# EAGLE design audioplayer (EAGLE 6.5.0)
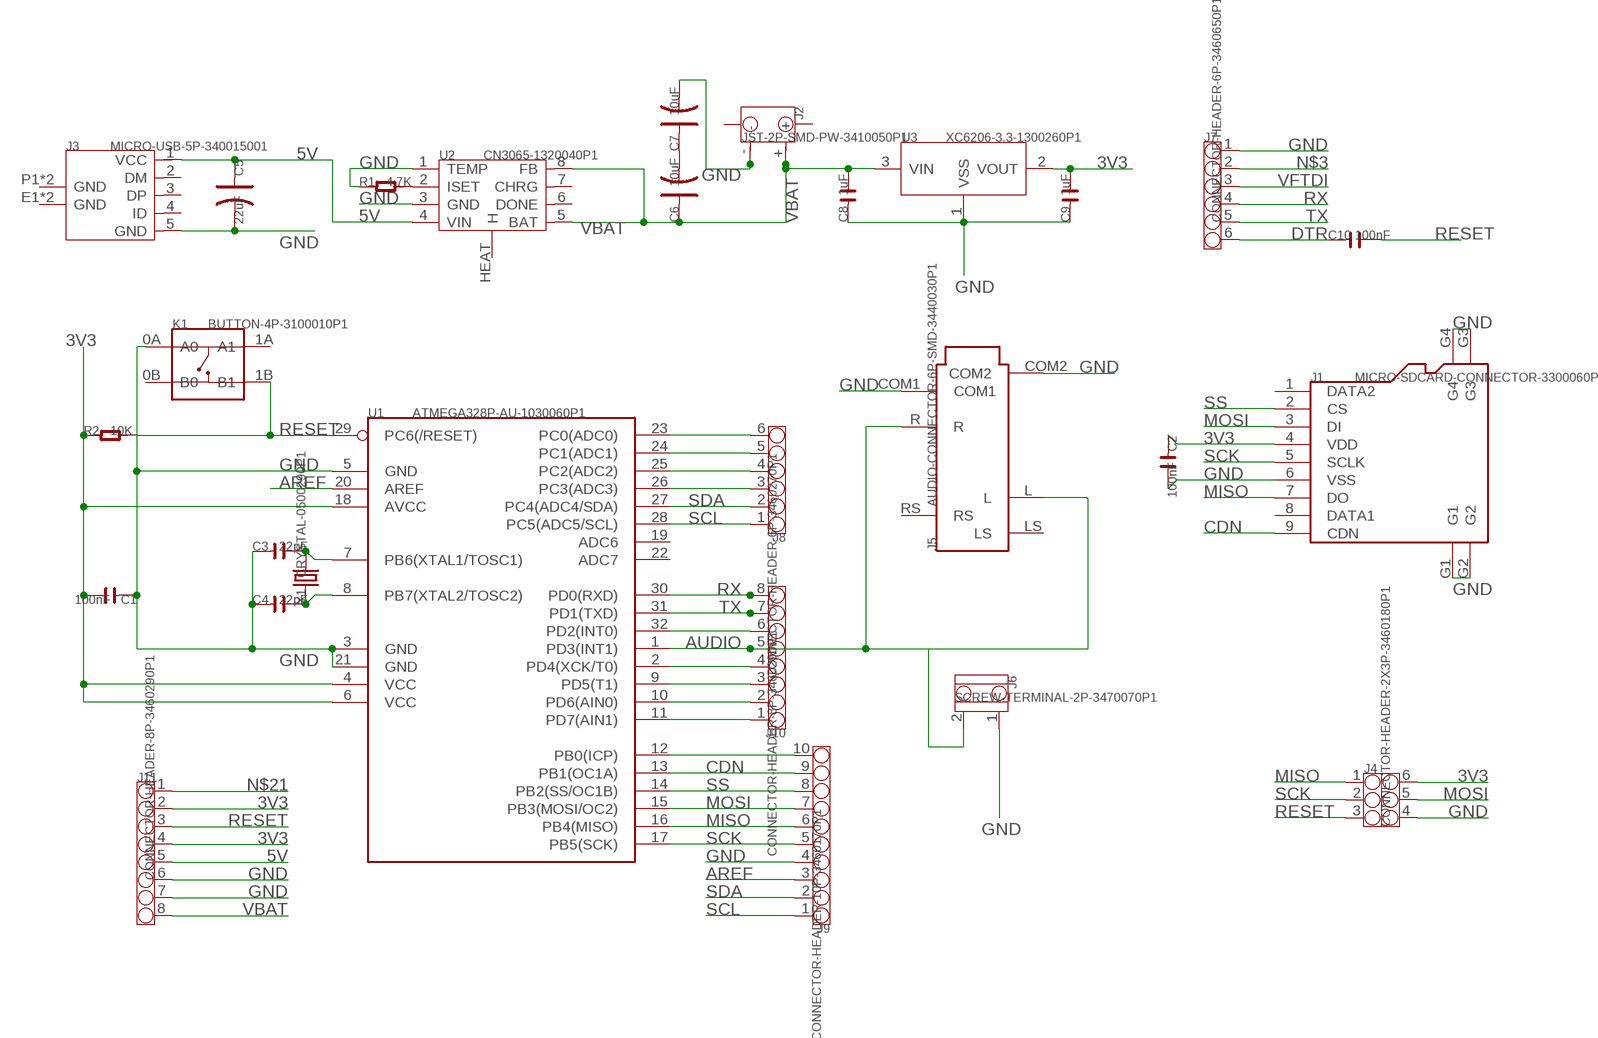
[diagram p0: schematic, sheet 1]

## Parts
C1  100nF  C-0603  [C0603]
C2  100nF  C-0603  [C0603]
C3  22pF  C-0603  [C0603]
C4  22pF  C-0603  [C0603]
C5  22uF  C-POLAR-B  [AVX-B]
C6  10uF  C-POLAR-A  [AVX-A]
C7  10uF  C-POLAR-A  [AVX-A]
C8  1uF  C-0805  [C0805]
C9  1uF  C-0805  [C0805]
C10  100nF  C-0603  [C0603]
J1  MICRO-SDCARD-CONNECTOR-3300060P1  [9P-SMD-W-RING]
J2  JST-2P-SMD-PW-3410050P1  [2P-SMD-2.0-90D]
J3  MICRO-USB-5P-340015001  [B-SMD-5P]
J4  CONNECTOR-HEADER-2X3P-3460180P1  [2X3P-2.54-2.54-11.6-3.0-BLACK-MALE]
J5  AUDIO-CONNECTOR-6P-SMD-3440030P1  [6P-SMD-3.5]
J6  SCREW-TERMINAL-2P-3470070P1  [2P-3.5]
J7  CONNECTOR-HEADER-6P-3460650P1  [1X6P-2.54-2.54-11.6-3.0-BLACK-MALE]
J8  CONNECTOR-HEADER-6P-3460270P1  [1X6P-2.54-8.5-BLACK-FEMALE]
J9  CONNECTOR-HEADER-10P-3460170P1  [1X10P-2.54-8.5-YELLOW-FEMALE]
J10  CONNECTOR-HEADER-8P-3460290P1  [1X8P-2.54-8.5-BLACK-FEMALE]
J11  CONNECTOR-HEADER-8P-3460290P1  [1X8P-2.54-8.5-BLACK-FEMALE]
K1  BUTTON-4P-3100010P1  [4P-SMD-6.0X6.0X5.0H]
R1  4.7K  R-0603  [R0603]
R2  10K  R-0603  [R0603]
U1  ATMEGA328P-AU-1030060P1  [TQFP32]
U2  CN3065-1320040P1  [DFN8]
U3  XC6206-3.3-1300260P1  [SOT23]
X1  CRYSTAL-0500290P1  [2P-SMD-5.0X3.2]

## Nets
3V3 [power]: C1.2 C2.1 C9.2 J1.4(VDD) J4.6 J11.2 J11.4 R2.1 U1.4(VCC) U1.6(VCC) U1.18(AVCC) U3.2(VOUT)
5V [power]: C5.+ J3.1(VCC) J11.5 U2.4(VIN)
AREF: J9.3 U1.20(AREF)
AUDIO: J5.L J5.R J6.2 J10.5 U1.1(PD3(INT1))
CDN: J1.9(CDN) J9.9 U1.13(PB1(OC1A))
DTR: C10.1 J7.6
GND [power]: C1.1 C2.2 C3.1 C4.1 C5.- C7.- C8.1 C9.1 J1.6(VSS) J1.G1 J1.G2 J1.G3 J1.G4 J2.- J3.5(GND) J4.4 J5.COM1 J5.COM2 J6.1 J7.1 J9.4 J11.6 J11.7 K1.0A(A0) R1.1 U1.3(GND) U1.5(GND) U1.21(GND) U2.1(TEMP) U2.3(GND) U3.1(VSS)
MISO: J1.7(DO) J4.1 J9.6 U1.16(PB4(MISO))
MOSI: J1.3(DI) J4.5 J9.7 U1.15(PB3(MOSI/OC2))
N$1: C6.- C7.+
N$2: R1.2 U2.2(ISET)
N$3: J7.2
N$6: J8.3 U1.26(PC3(ADC3))
N$7: J8.4 U1.25(PC2(ADC2))
N$8: J8.5 U1.24(PC1(ADC1))
N$9: J8.6 U1.23(PC0(ADC0))
N$10: J9.10 U1.12(PB0(ICP))
N$11: J10.1 U1.11(PD7(AIN1))
N$12: J10.2 U1.10(PD6(AIN0))
N$13: J10.3 U1.9(PD5(T1))
N$14: J10.4 U1.2(PD4(XCK/T0))
N$15: J10.6 U1.32(PD2(INT0))
N$21: J11.1
N$25: C3.2 U1.7(PB6(XTAL1/TOSC1)) X1.2
N$28: C4.2 U1.8(PB7(XTAL2/TOSC2)) X1.1
RESET: C10.2 J4.3 J11.3 K1.1B(B1) R2.2 U1.29(PC6(/RESET))
RX: J7.4 J10.8 U1.30(PD0(RXD))
SCK: J1.5(SCLK) J4.2 J9.5 U1.17(PB5(SCK))
SCL: J8.1 J9.1 U1.28(PC5(ADC5/SCL))
SDA: J8.2 J9.2 U1.27(PC4(ADC4/SDA))
SS: J1.2(CS) J9.8 U1.14(PB2(SS/OC1B))
TX: J7.5 J10.7 U1.31(PD1(TXD))
VBAT [power]: C6.+ C8.2 J2.+ J11.8 U2.5(BAT) U2.8(FB) U3.3(VIN)
VFTDI [power]: J7.3
Unconnected: J1.1(DATA2) J1.8(DATA1) J2.3 J2.4 J3.2(DM) J3.3(DP) J3.4(ID) J3.E1(GND) J3.E2(GND) J3.P1(GND) J3.P2(GND) J5.LS J5.RS K1.0B(B0) K1.1A(A1) U1.19(ADC6) U1.22(ADC7) U2.6(DONE) U2.7(CHRG) U2.HEAT(H)

## Library data of the parts
C1-C4 C8-C10 = OPL:C*
C5-C7 = OPL:C-POLAR*
J1 = OPL:MICRO-SDCARD-CONNECTOR: Micro SD Card
J2 = OPL:JST-2P-SMD-PW
J3 = OPL:MICRO-USB-5P: ST-USB-001E：MICRO USB B SMD R/A
J4 = OPL:CONNECTOR-HEADER-2X3P
J5 = OPL:AUDIO-CONNECTOR-6P-SMD
J6 = OPL:SCREW-TERMINAL-2P
J7 J8 = OPL:CONNECTOR-HEADER-6P
J9 = OPL:CONNECTOR-HEADER-10P
J10 J11 = OPL:CONNECTOR-HEADER-8P
K1 = OPL:BUTTON-4P
R1 R2 = OPL:R*
U1 = OPL:ATMEGA328P-AU: 8-bit AVR Microcontroller with 32K Bytes In-System Programmable Flash
U2 = OPL:CN3065: USB-Compatible Lithiumt-Ion Battery Charger with Thermal Regulation http://www.consonance-elec.com/pdf/%E6%8A%80%E6%9C%AF%E8%AF%B4%E6%98%8E%E4%B9%A6/DSC-CN3065.pdf
U3 = OPL:XC6206-3.3: LOW ESR Cap.Compatible Positive Voltage Regulators
X1 = OPL:CRYSTAL*

## Net classes
1 power: width 0.254 mm

## Board
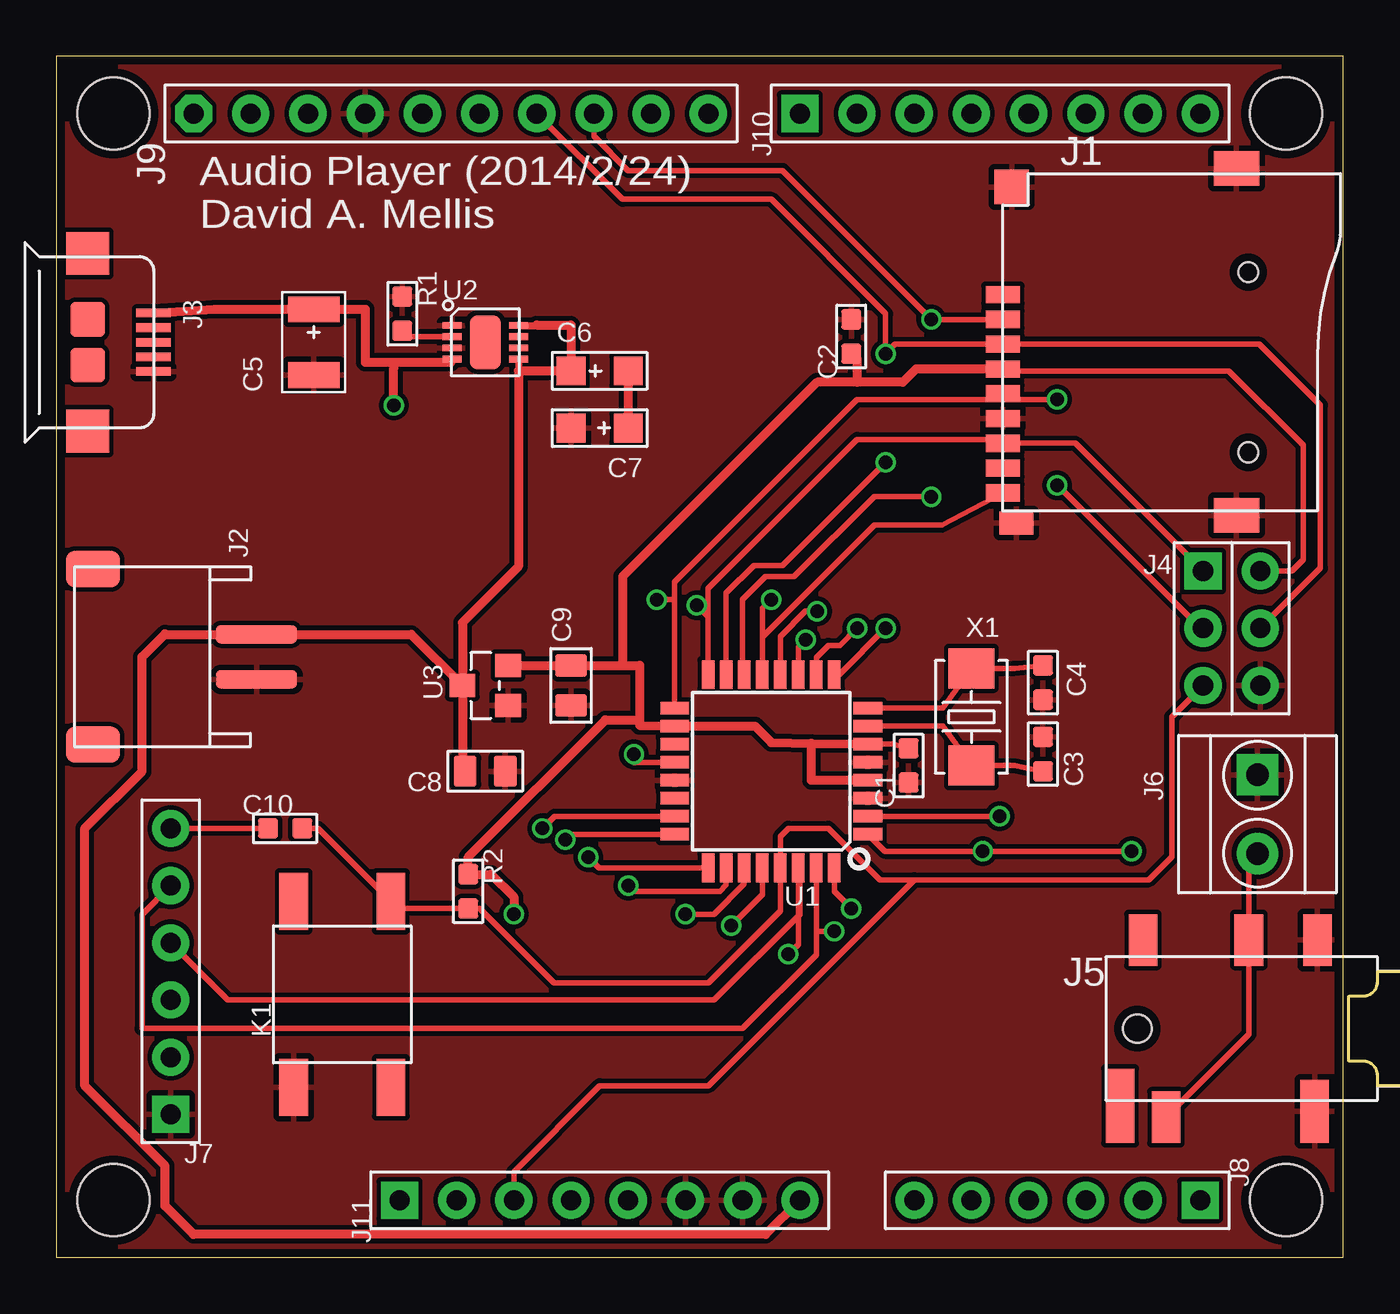
[diagram p1: board, top side]
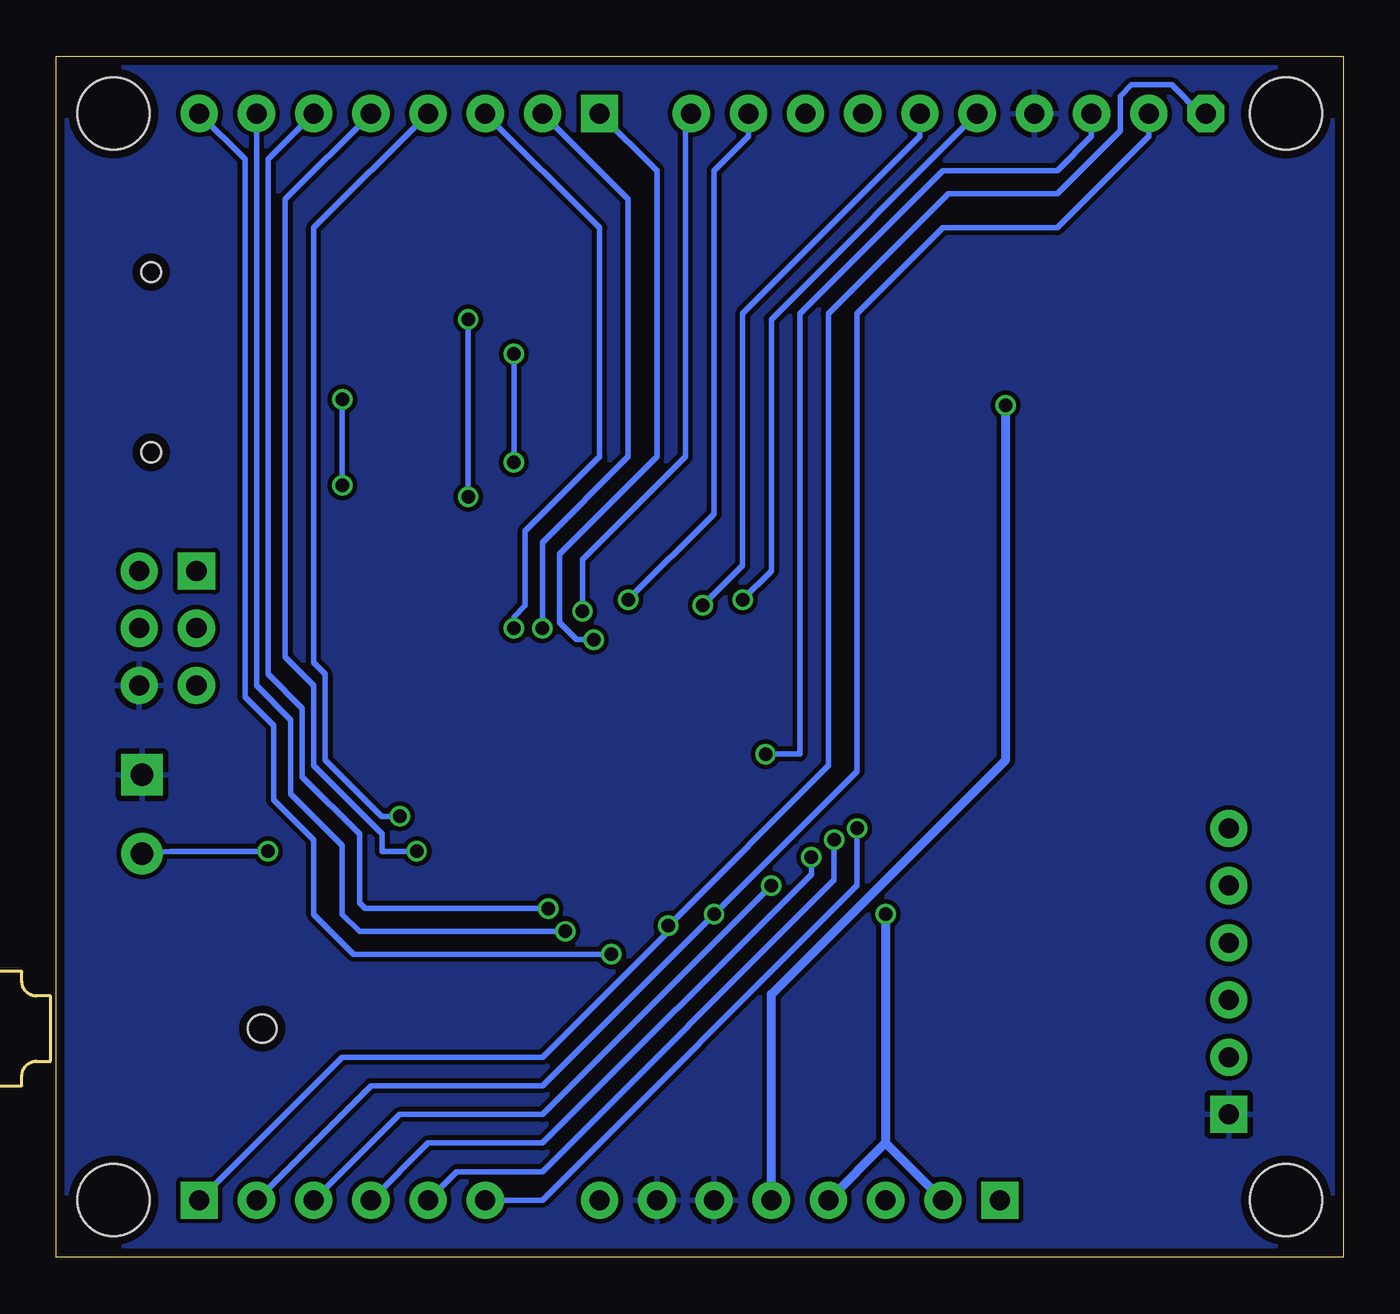
[diagram p2: board, bottom side, seen from below]

Size 57.15 x 53.34 mm. Coordinates in mm from the lower left corner, seen from the top.
Outline: 57.15,0 57.15,53.34 0,53.34 0,0 57.15,0
Copper layers (1*2*15*16): Top 0.035mm / dielectric 0.2mm / Route2 0.0175mm / dielectric 1.1mm / Route15 0.0175mm / dielectric 0.2mm / Bottom 0.035mm
Design rules "SeeedStudio_DRU_no_angle_20130527 *": minimum track width 6mil, minimum drill 12mil, track to track 8mil, track to pad 8mil, pad to pad 8mil, via to via 8mil, smd to smd 0mil, copper to edge 15mil, drill to drill 15mil, minimum pad ring 6mil, minimum via ring 6mil, stop-mask expansion 2mil, vias tented up to drill 25mil, thermal gap 10mil
Holes 3.2 mm at 54.61,2.54 54.61,50.8 2.54,50.8 2.54,2.54

### Footprints (pad centres in the part's own frame; a part is rotated, then mirrored left to right if it is on the bottom)
C0603 = smd 0.889 x 0.889: 1 -0.762,0; 2 0.762,0
AVX-B = smd 1.143 x 2.286: + -1.46,0; - 1.46,0
AVX-A = smd 1.27 x 1.27: + -1.27,0; - 1.27,0
C0805 = smd 1.016 x 1.397: 1 -0.889,0; 2 0.889,0
9P-SMD-W-RING = smd 1.524 x 0.762: 1 -7.493,2.114; 2 -7.493,1.014; 3 -7.493,-0.086; 4 -7.493,-1.186; 5 -7.493,-2.286; 6 -7.493,-3.386; 7 -7.493,-4.486; 8 -7.493,-5.586; 9 -7.493,-6.686 | smd 1.524 x 1.016: G1 -6.893,-8.032 | smd 2.032 x 1.524: G2 2.88,-7.686; G3 2.88,7.714 | smd 1.524 x 1.524: G4 -7.101,6.895 | hole 0.889: 3.407,-4.886; 3.407,3.114
2P-SMD-2.0-90D = smd 1.6 x 2.4: 3 3.9,-2.181; 4 -3.9,-2.181 | smd 0.8 x 3.6: + -1,5.08; - 1,5.08
B-SMD-5P = smd 0.38 x 1.52: 1 -1.3,2.54; 2 -0.65,2.54; 3 0,2.54; 4 0.65,2.54; 5 1.3,2.54 | smd 1.524 x 1.524: E1 -1.016,-0.381; E2 1.016,-0.381 | smd 1.9 x 1.9: P1 -3.95,-0.381; P2 3.95,-0.381
2X3P-2.54-2.54-11.6-3.0-BLACK-MALE = drill 0.889 pad 1.651 square: 1 -1.27,2.54 | drill 0.889 pad 1.651: 2 -1.27,0; 3 -1.27,-2.54; 4 1.27,-2.54; 5 1.27,0; 6 1.27,2.54
6P-SMD-3.5 = smd 1.27 x 2.286: COM1 2.413,3.937; L -4.318,-3.937; R -0.635,3.937; RS -5.334,3.937 | smd 1.27 x 2.794: COM2 2.286,-3.683 | smd 1.27 x 3.302: LS -6.35,-3.429 | hole 1.27: -5.588,0
2P-3.5 = drill 1 pad 1.85 square: 1 -1.75,0 | drill 1 pad 1.85: 2 1.75,0
1X6P-2.54-2.54-11.6-3.0-BLACK-MALE = drill 0.889 pad 1.651 square: 1 0,6.35 | drill 0.889 pad 1.651: 2 0,3.81; 3 0,1.27; 4 0,-1.27; 5 0,-3.81; 6 0,-6.35
1X6P-2.54-8.5-BLACK-FEMALE = drill 0.889 pad 1.651 square: 1 0,6.35 | drill 0.889 pad 1.651: 2 0,3.81; 3 0,1.27; 4 0,-1.27; 5 0,-3.81; 6 0,-6.35
1X10P-2.54-8.5-YELLOW-FEMALE = drill 0.889 pad 1.651 octagon: 1 0,11.43 | drill 0.889 pad 1.651: 2 0,8.89; 3 0,6.35; 4 0,3.81; 5 0,1.27; 6 0,-1.27; 7 0,-3.81; 8 0,-6.35; 9 0,-8.89; 10 0,-11.43
1X8P-2.54-8.5-BLACK-FEMALE = drill 0.889 pad 1.651 square: 1 0,8.89 | drill 0.889 pad 1.651: 2 0,6.35; 3 0,3.81; 4 0,1.27; 5 0,-1.27; 6 0,-3.81; 7 0,-6.35; 8 0,-8.89
4P-SMD-6.0X6.0X5.0H = smd 2.54 x 1.27: 0A -4.129,2.159; 0B 4.129,2.159; 1A -4.129,-2.159; 1B 4.129,-2.159
R0603 = smd 0.889 x 0.889: 1 -0.762,0; 2 0.762,0
TQFP32 = smd 1.27 x 0.559: 1 -4.293,2.8; 2 -4.293,2; 3 -4.293,1.2; 4 -4.293,0.4; 5 -4.293,-0.4; 6 -4.293,-1.2; 7 -4.293,-2; 8 -4.293,-2.8; 17 4.293,-2.8; 18 4.293,-2; 19 4.293,-1.2; 20 4.293,-0.4; 21 4.293,0.4; 22 4.293,1.2; 23 4.293,2; 24 4.293,2.8 | smd 0.559 x 1.27: 9 -2.8,-4.293; 10 -2,-4.293; 11 -1.2,-4.293; 12 -0.4,-4.293; 13 0.4,-4.293; 14 1.2,-4.293; 15 2,-4.293; 16 2.8,-4.293; 25 2.8,4.293; 26 2,4.293; 27 1.2,4.293; 28 0.4,4.293; 29 -0.4,4.293; 30 -1.2,4.293; 31 -2,4.293; 32 -2.8,4.293
DFN8 = smd 0.854 x 0.3: 1 -1.477,0.75; 2 -1.477,0.25; 3 -1.477,-0.25; 4 -1.477,-0.75; 5 1.477,-0.75; 6 1.477,-0.25; 7 1.477,0.25; 8 1.477,0.75 | smd 1.397 x 2.413: HEAT 0,0
SOT23 = smd 1.016 x 1.143: 1 -0.889,-1.016; 2 0.889,-1.016; 3 0,1.016
2P-SMD-5.0X3.2 = smd 1.778 x 2.032: 1 -2.159,0; 2 2.159,0

### Placement (x,y rotation side)
C1  37.85,21.84 90 top
C2  35.31,40.89 90 top
C3  43.81,22.35 270 top
C4  43.81,25.53 90 top
C5  11.43,40.64 270 top
C6  24.13,39.37 0 top
C7  24.13,36.83 180 top
C8  19.05,21.59 180 top
C9  22.86,25.4 90 top
C10  10.16,19.05 0 top
J1  49.53,40.64 0 top
J2  3.81,26.67 270 top
J3  1.78,40.64 270 top
J4  52.2,27.94 0 top
J5  53.59,10.16 0 top
J6  53.34,19.68 270 top
J7  5.08,12.7 180 top
J8  44.45,2.54 270 top
J9  17.53,50.8 90 top
J10  41.91,50.8 90 top
J11  24.13,2.54 90 top
K1  12.7,11.68 90 top
R1  15.37,41.91 270 top
R2  18.29,16.26 270 top
U1  31.75,21.59 180 top
U2  19.05,40.64 0 top
U3  19.05,25.4 90 top
X1  40.64,24 270 top

### Tracks (layer width: path | path; a pad name or v marks a point on that pad's centre or on a via)
3V3  (via drill 0.6)
  Top 0.254: J1.4 42.12,39.37 52.07,39.37 55.37,36.07 55.37,30.99 54.86,30.48 J4.6 | C1.2 37.15,22.79 U1.6
  Top 0.406: U3.2 C9.2 25.15,26.29 | 33.54,22.83 31.75,22.86 31.02,23.59 U1.18 25.91,23.62 25.91,23.88 | 33.54,22.83 U1.6 | U1.4 33.54,21.19 33.54,22.83 | J1.4 38.18,39.45 37.59,38.86 35.56,38.86 | 35.56,38.86 33.78,38.86 25.15,30.23 25.15,26.29 | v20.32,15.24 20.32,16 19.3,17.02 R2.1 18.29,17.78 24.38,23.88 25.91,23.88 | C2.1 35.56,39.88 35.56,38.86 | 25.15,26.29 25.91,26.29 25.91,23.88
  Bottom 0.406: v20.32,15.24 20.32,5.08 | 20.32,5.08 J11.2 | J11.4 20.32,5.08
5V  (via drill 0.6)
  Top 0.254: U2.4 17.53,39.89 17.53,39.75 | 14.99,39.5 14.73,39.75
  Top 0.406: J3.1 7.02,42.1 C5.+ 13.72,42.1 13.72,39.75 14.73,39.75 17.53,39.75 | v14.99,37.85 14.99,39.5
  Bottom 0.406: J11.5 25.4,11.68 14.99,22.1 v14.99,37.85
AREF  (via drill 0.6)
  Top 0.254: U1.20 25.65,21.99 v25.65,22.35
  Bottom 0.254: J9.3 11.18,49.78 12.7,48.26 17.78,48.26 24.13,41.91 24.13,22.35 v25.65,22.35
AUDIO  (via drill 0.6)
  Top 0.254: U1.1 36.8,18.03 v41.15,18.03 v47.75,18.03 | J6.2 52.96,17.55 J5.R 52.96,9.91 J5.L
  Bottom 0.254: J10.5 46.99,46.99 46.99,26.67 45.72,25.4 45.72,21.84 42.67,18.8 42.67,18.03 v41.15,18.03 | v47.75,18.03 52.07,18.03 J6.2
CDN  (via drill 0.6)
  Top 0.254: J1.9 39.33,32.51 36.32,32.51 31.35,27.54 U1.13 31.35,28.85 v31.75,29.21
  Bottom 0.254: J9.9 26.42,49.78 27.94,48.26 27.94,33.02 v31.75,29.21
DTR
  Top 0.254: C10.1 J7.6
GND
  pour Top: 0,53.34 57.15,53.34 57.15,0 0,0
  pour Bottom: 0,53.34 57.15,53.34 57.15,0 0,0
MISO  (via drill 0.6)
  Top 0.254: J4.1 45.25,36.15 J1.7 41.7,36.32 35.56,36.32 28.95,29.71 U1.16 28.95,28.45 v28.45,28.96
  Bottom 0.254: J9.6 18.8,49.78 26.67,41.91 26.67,30.73 v28.45,28.96
MOSI  (via drill 0.6)
  Top 0.254: U1.15 29.75,29.5 30.99,30.73 32.26,30.73 v36.83,35.31 | J4.5 56.13,30.61 56.13,37.85 53.43,40.55 J1.3 37.25,40.55 v36.83,40.13 36.83,41.91 31.75,46.99 25.15,46.99 J9.7
  Bottom 0.254: v36.83,35.31 v36.83,40.13
N$1
  Top 0.406: C6.- C7.+
N$2
  Top 0.254: U2.2 15.37,40.89 R1.2
N$6  (via drill 0.6)
  Top 0.254: U1.26 29.75,16.54 29.46,16.26 25.65,16.26 v25.4,16.51
  Bottom 0.254: v25.4,16.51 35.56,6.35 41.91,6.35 J8.3
N$7  (via drill 0.6)
  Top 0.254: U1.25 24.11,17.3 v23.62,17.78
  Bottom 0.254: v23.62,17.78 23.62,17.02 35.56,5.08 40.64,5.08 J8.4
N$8  (via drill 0.6)
  Top 0.254: U1.24 22.85,18.79 v22.61,18.54
  Bottom 0.254: v22.61,18.54 22.61,16.76 35.56,3.81 39.37,3.81 J8.5
N$9  (via drill 0.6)
  Top 0.254: U1.23 22.13,19.59 v21.59,19.05
  Bottom 0.254: v21.59,19.05 21.59,16.51 35.56,2.54 J8.6
N$10  (via drill 0.6)
  Top 0.254: U1.12 32.15,27.58 33.27,28.7 v33.78,28.7
  Bottom 0.254: v33.78,28.7 33.78,30.99 29.21,35.56 29.21,50.55 J9.10
N$11  (via drill 0.6)
  Top 0.254: U1.11 32.95,27.11 v33.27,27.43
  Bottom 0.254: v33.27,27.43 34.04,27.43 34.8,28.19 34.8,31.24 30.48,35.56 30.48,48.26 J10.1
N$12  (via drill 0.6)
  Top 0.254: U1.10 33.75,26.64 34.29,27.18 34.8,27.18 v35.56,27.94
  Bottom 0.254: v35.56,27.94 35.56,31.75 31.75,35.56 31.75,46.99 J10.2
N$13  (via drill 0.6)
  Top 0.254: U1.9 34.77,25.88 v36.83,27.94
  Bottom 0.254: v36.83,27.94 36.83,28.45 36.32,28.96 36.32,32.26 33.02,35.56 33.02,45.72 J10.3
N$14  (via drill 0.6)
  Top 0.254: v41.89,19.59 U1.2
  Bottom 0.254: J10.4 45.72,45.72 45.72,26.42 45.21,25.91 45.21,22.1 42.7,19.59 v41.89,19.59
N$15  (via drill 0.6)
  Top 0.254: U1.32 34.55,16.25 v35.31,15.49
  Bottom 0.254: v35.31,15.49 43.43,15.49 43.69,15.75 43.69,18.8 46.23,21.34 46.23,24.38 47.75,25.91 47.75,48.77 J10.6
N$25
  Top 0.254: U1.7 39.37,23.59 X1.2 42.55,21.84 C3.2
N$28
  Top 0.254: U1.8 39.37,24.39 X1.1 42.55,26.16 C4.2
RESET
  Top 0.254: 38.1,16.76 36.58,16.76 34.29,19.05 32.51,19.05 32.15,18.69 U1.29 32.15,15.39 28.96,12.19 22.1,12.19 18.8,15.49 R2.2 15.18,15.49 K1.1B 11.62,19.05 C10.2 | J11.3 20.32,3.81 24.13,7.62 28.96,7.62 38.1,16.76 | 38.1,16.76 48.51,16.76 49.53,17.78 49.53,24 J4.3
RX  (via drill 0.6)
  Top 0.254: J7.4 7.62,11.43 29.21,11.43 33.02,15.24 33.02,17.23 U1.30 32.95,13.9 v32.51,13.46
  Bottom 0.254: v32.51,13.46 43.94,13.46 45.72,15.24 45.72,18.54 47.5,20.32 47.5,23.62 48.77,24.89 48.77,48.77 J10.8
SCK  (via drill 0.6)
  Top 0.254: U1.17 27.46,29.21 | 27.46,29.21 27.46,30 35.56,38.1 41.78,38.1 J1.5 42.29,38.1 v44.45,38.1 | J4.2 50.8,27.94 v44.45,34.29 | v26.67,29.21 27.46,29.21
  Bottom 0.254: v44.45,34.29 v44.45,38.1 | J9.5 25.4,41.66 25.4,30.48 v26.67,29.21
SCL  (via drill 0.6)
  Top 0.254: U1.28 31.35,16.11 v29.97,14.73
  Bottom 0.254: J8.1 44.45,8.89 35.56,8.89 29.97,14.48 v29.97,14.73 22.86,21.84 22.86,41.91 17.53,47.24 12.7,47.24 9.91,50.04 9.91,51.56 9.4,52.07 7.62,52.07 6.35,50.8 J9.1
SDA  (via drill 0.6)
  Top 0.254: U1.27 30.55,16.58 29.21,15.24 v27.94,15.24
  Bottom 0.254: J8.2 43.18,7.62 35.56,7.62 v27.94,15.24 21.59,21.59 21.59,41.91 17.78,45.72 12.7,45.72 8.64,49.78 J9.2
SS  (via drill 0.6)
  Top 0.254: U1.14 30.48,25.88 30.48,29.21 31.5,30.23 32.77,30.23 36.32,33.78 v38.86,33.78 | J1.2 v38.86,41.65 v38.86,41.66 32.26,48.26 25.4,48.26 23.88,49.78 J9.8
  Bottom 0.254: v38.86,33.78 v38.86,41.66
TX  (via drill 0.6)
  Top 0.254: J7.5 3.81,15.24 3.81,10.16 30.48,10.16 33.75,13.43 33.75,14.48 | U1.31 33.75,14.48 | 33.75,14.48 v34.54,14.48
  Bottom 0.254: v34.54,14.48 43.69,14.48 44.45,15.24 44.45,18.29 46.74,20.57 46.74,23.88 48.26,25.4 J10.7
VBAT
  Top 0.305: U2.8 21.32,41.39 21.34,41.4 | U2.5 20.53,39.37
  Top 0.406: U3.3 18.03,28.19 20.53,30.69 20.53,39.37 C6.+ 22.86,41.39 22.85,41.4 21.34,41.4 | U3.3 15.76,27.67 J2.+ 4.84,27.67 4.83,27.69 3.81,26.67 3.81,21.59 1.27,19.05 1.27,7.62 4.83,4.06 4.83,2.29 6.1,1.02 31.5,1.02 J11.8 | U3.3 18.03,21.72 C8.2

### Text on the board
tNames: Audio Player (2014/2/24) / David A. Mellis